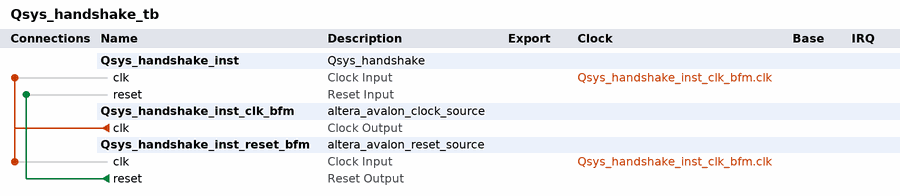
[diagram p0: system contents]
# Platform Designer (Qsys) system Qsys_handshake_tb, Cyclone IV E EP4CE10E22A7
# Parameters at their usual value, and those the tool derives, are not listed.
package require -exact qsys 16.1
create_system Qsys_handshake_tb
set_project_property DEVICE_FAMILY {Cyclone IV E}
set_project_property DEVICE EP4CE10E22A7

add_instance Qsys_handshake_inst Qsys_handshake 1.0

add_instance Qsys_handshake_inst_clk_bfm altera_avalon_clock_source 16.1

add_instance Qsys_handshake_inst_reset_bfm altera_avalon_reset_source 16.1
set_instance_parameter_value Qsys_handshake_inst_reset_bfm ASSERT_HIGH_RESET 0
set_instance_parameter_value Qsys_handshake_inst_reset_bfm INITIAL_RESET_CYCLES 50

# connections
add_connection Qsys_handshake_inst_clk_bfm.clk Qsys_handshake_inst.clk clock
add_connection Qsys_handshake_inst_clk_bfm.clk Qsys_handshake_inst_reset_bfm.clk clock
add_connection Qsys_handshake_inst_reset_bfm.reset Qsys_handshake_inst.reset reset

set_interconnect_requirement {$system} qsys_mm.clockCrossingAdapter HANDSHAKE
set_interconnect_requirement {$system} qsys_mm.enableEccProtection FALSE
set_interconnect_requirement {$system} qsys_mm.insertDefaultSlave FALSE
set_interconnect_requirement {$system} qsys_mm.maxAdditionalLatency 1

save_system Qsys_handshake_tb.qsys
